# EAGLE schematic rca-board (EAGLE 6.6.0)
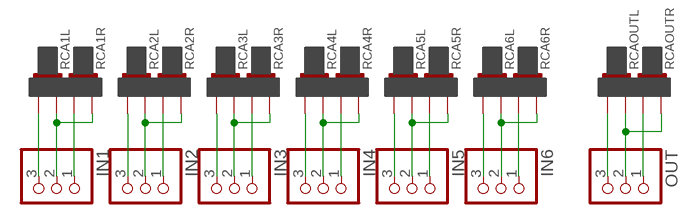
[diagram p0: schematic, sheet 1]

## Parts
IN1  PINHD-1X3  [1X03]
IN2  PINHD-1X3  [1X03]
IN3  PINHD-1X3  [1X03]
IN4  PINHD-1X3  [1X03]
IN5  PINHD-1X3  [1X03]
IN6  PINHD-1X3  [1X03]
OUT  PINHD-1X3  [1X03]
RCA1L  CMC_RCA816  [CMC_RCA_816]
RCA1R  CMC_RCA816  [CMC_RCA_816]
RCA2L  CMC_RCA816  [CMC_RCA_816]
RCA2R  CMC_RCA816  [CMC_RCA_816]
RCA3L  CMC_RCA816  [CMC_RCA_816]
RCA3R  CMC_RCA816  [CMC_RCA_816]
RCA4L  CMC_RCA816  [CMC_RCA_816]
RCA4R  CMC_RCA816  [CMC_RCA_816]
RCA5L  CMC_RCA816  [CMC_RCA_816]
RCA5R  CMC_RCA816  [CMC_RCA_816]
RCA6L  CMC_RCA816  [CMC_RCA_816]
RCA6R  CMC_RCA816  [CMC_RCA_816]
RCAOUTL  CMC_RCA816  [CMC_RCA_816]
RCAOUTR  CMC_RCA816  [CMC_RCA_816]

## Nets
GND1: IN1.2 RCA1L.GND RCA1R.GND
GND2: IN2.2 RCA2L.GND RCA2R.GND
GND3: IN3.2 RCA3L.GND RCA3R.GND
GND4: IN4.2 RCA4L.GND RCA4R.GND
GND5: IN5.2 RCA5L.GND RCA5R.GND
GND6: IN6.2 RCA6L.GND RCA6R.GND
GNDOUT: OUT.2 RCAOUTL.GND RCAOUTR.GND
N$1: IN2.3 RCA2L.SIGNAL
N$2: IN1.3 RCA1L.SIGNAL
N$3: IN3.3 RCA3L.SIGNAL
N$4: IN2.1 RCA2R.SIGNAL
N$5: IN4.3 RCA4L.SIGNAL
N$6: IN3.1 RCA3R.SIGNAL
N$7: IN5.3 RCA5L.SIGNAL
N$8: IN4.1 RCA4R.SIGNAL
N$9: IN6.3 RCA6L.SIGNAL
N$10: IN5.1 RCA5R.SIGNAL
N$11: OUT.1 RCAOUTR.SIGNAL
N$12: IN6.1 RCA6R.SIGNAL
N$13: IN1.1 RCA1R.SIGNAL
N$15: OUT.3 RCAOUTL.SIGNAL

## Library data of the parts
IN1-IN6 OUT = pinhead:PINHD-1X3: PIN HEADER
RCA1L RCA1R RCA2L RCA2R RCA3L RCA3R RCA4L RCA4R RCA5L RCA5R RCA6L RCA6R RCAOUTL RCAOUTR = cmc-rca-sockets:CMC_RCA: RCA sockets